# Altium project XUF208_Breakout.PrjPcb
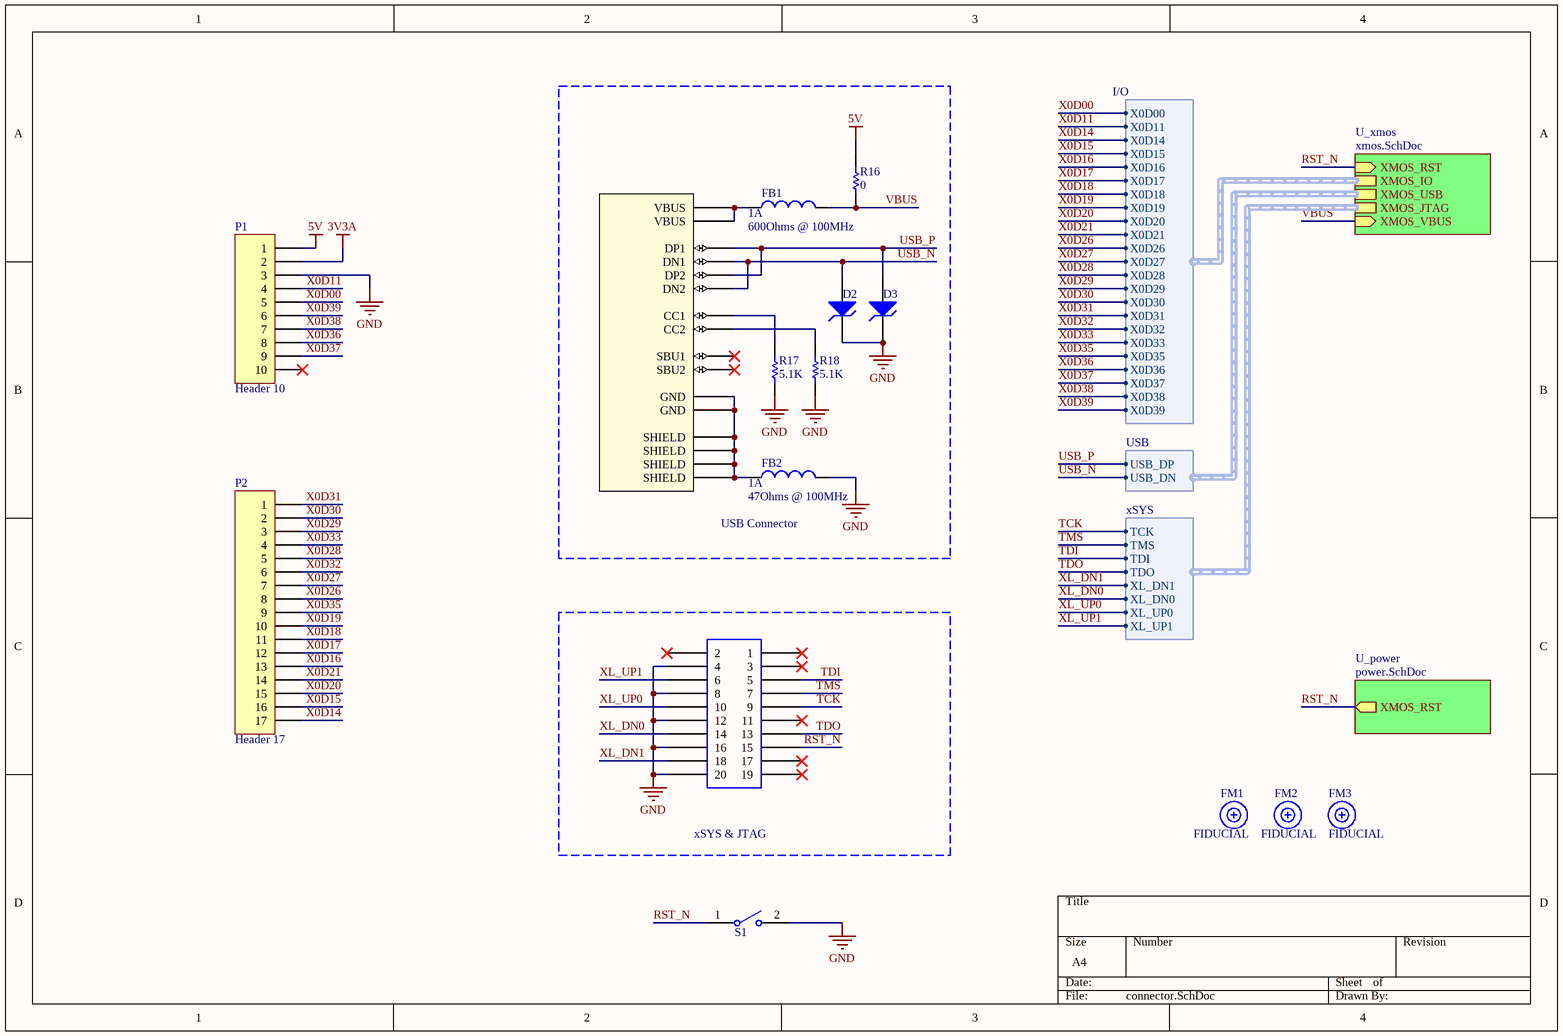
[diagram p0: connector.SchDoc]
3 sheets, 55 parts. Net scope: hierarchical (ports join the sheet entries above them; power ports are global).
Board file: XUF208_Breakout.PcbDoc
Sheets:
  connector.SchDoc
    U_power = power.SchDoc
    U_xmos = xmos.SchDoc

## Sheet connector.SchDoc
size A4; DocumentNumber: 3; SheetNumber: 3; SheetTotal: 3

### Parts
D2  ESD9B  [SOD-923-2]  (value not drawn)
D3  ESD9B  [SOD-923-2]  (value not drawn)
FB1  Impedance: 600Ohms @ 100MHz  MaximumDCCurrent: 1A  [IND_1608]  (hidden comment: Ferrite)
FB2  Impedance: 47Ohms @ 100MHz  MaximumDCCurrent: 1A  [IND_1608]  (hidden comment: Ferrite)
FM1  FIDUCIAL  [FIDUCIAL_10_20]
FM2  FIDUCIAL  [FIDUCIAL_10_20]
FM3  FIDUCIAL  [FIDUCIAL_10_20]
J1  USB C RECEPTACLE(1)  [USB C RECEPTACLE 2(1)]  (value not drawn)
J2  DC3-20P  [IDC-20 (1)]  (value not drawn)
P1  Header 10  [HDR1X10]
P2  Header 17  [HDR1X17]
R16  value 0  [RC0603N]  (hidden comment: RES)
R17  value 5.1K  [RC0603N]  (hidden comment: RES)
R18  value 5.1K  [RC0603N]  (hidden comment: RES)
S1  Tact Switch SPST  [TS_SPST_W4.2XD3.2]  (value not drawn)

### Blocks framed on the sheet
USB Connector: D2 D3 FB1 FB2 J1 R16-R18
xSYS & JTAG: J2

### Sub-sheets
U_power = power.SchDoc: XMOS_RST (out)
U_xmos = xmos.SchDoc: XMOS_IO (harness I/O), XMOS_JTAG (harness xSYS), XMOS_VBUS (in), XMOS_USB (harness USB), XMOS_RST (in)

### Harnesses
I/O: X0D00, X0D11, X0D14, X0D15, X0D16, X0D17, X0D18, X0D19, X0D20, X0D21, X0D26, X0D27, X0D28, X0D29, X0D30, X0D31, X0D32, X0D33, X0D35, X0D36, X0D37, X0D38, X0D39
xSYS: TCK, TMS, TDI, TDO, XL_DN1, XL_DN0, XL_UP0, XL_UP1
USB: USB_DP, USB_DN

### Nets
3V3A: P1.2
5V: P1.1 R16.2
GND: D2.2 D3.2 FB2.2 J2.4 J2.8 J2.12 J2.16 J2.20 P1.3 R17.1 R18.1 S1.2
RST_N: J2.15 S1.1 ; sheet U_power/XMOS_RST, sheet U_xmos/XMOS_RST
TCK: J2.9 ; sheet U_xmos/XMOS_JTAG.TCK
TDI: J2.5 ; sheet U_xmos/XMOS_JTAG.TDI
TDO: J2.13 ; sheet U_xmos/XMOS_JTAG.TDO
TMS: J2.7 ; sheet U_xmos/XMOS_JTAG.TMS
USB_N: D2.1 J1.A7(DN1) J1.B7(DN2) ; sheet U_xmos/XMOS_USB.USB_DN
USB_P: D3.1 J1.A6(DP1) J1.B6(DP2) ; sheet U_xmos/XMOS_USB.USB_DP
VBUS: FB1.2 R16.1 ; sheet U_xmos/XMOS_VBUS
X0D00: P1.5 ; sheet U_xmos/XMOS_IO.X0D00
X0D11: P1.4 ; sheet U_xmos/XMOS_IO.X0D11
X0D14: P2.17 ; sheet U_xmos/XMOS_IO.X0D14
X0D15: P2.16 ; sheet U_xmos/XMOS_IO.X0D15
X0D16: P2.13 ; sheet U_xmos/XMOS_IO.X0D16
X0D17: P2.12 ; sheet U_xmos/XMOS_IO.X0D17
X0D18: P2.11 ; sheet U_xmos/XMOS_IO.X0D18
X0D19: P2.10 ; sheet U_xmos/XMOS_IO.X0D19
X0D20: P2.15 ; sheet U_xmos/XMOS_IO.X0D20
X0D21: P2.14 ; sheet U_xmos/XMOS_IO.X0D21
X0D26: P2.8 ; sheet U_xmos/XMOS_IO.X0D26
X0D27: P2.7 ; sheet U_xmos/XMOS_IO.X0D27
X0D28: P2.5 ; sheet U_xmos/XMOS_IO.X0D28
X0D29: P2.3 ; sheet U_xmos/XMOS_IO.X0D29
X0D30: P2.2 ; sheet U_xmos/XMOS_IO.X0D30
X0D31: P2.1 ; sheet U_xmos/XMOS_IO.X0D31
X0D32: P2.6 ; sheet U_xmos/XMOS_IO.X0D32
X0D33: P2.4 ; sheet U_xmos/XMOS_IO.X0D33
X0D35: P2.9 ; sheet U_xmos/XMOS_IO.X0D35
X0D36: P1.8 ; sheet U_xmos/XMOS_IO.X0D36
X0D37: P1.9 ; sheet U_xmos/XMOS_IO.X0D37
X0D38: P1.7 ; sheet U_xmos/XMOS_IO.X0D38
X0D39: P1.6 ; sheet U_xmos/XMOS_IO.X0D39
XL_DN0: J2.14 ; sheet U_xmos/XMOS_JTAG.XL_DN0
XL_DN1: J2.18 ; sheet U_xmos/XMOS_JTAG.XL_DN1
XL_UP0: J2.10 ; sheet U_xmos/XMOS_JTAG.XL_UP0
XL_UP1: J2.6 ; sheet U_xmos/XMOS_JTAG.XL_UP1
NetFB1_1: FB1.1 J1.A4/B9(VBUS) J1.B4/A9(VBUS)
NetFB2_1: FB2.1 J1.A1/B12(GND) J1.B1/A12(GND) J1.SH1(SHIELD) J1.SH2(SHIELD) J1.SH3(SHIELD) J1.SH4(SHIELD)
NetJ1_A5: J1.A5(CC1) R17.2
NetJ1_B5: J1.B5(CC2) R18.2

Not connected (* = marked no-connect by the designer): J1 A8(SBU1)* B8(SBU2)*; J2 1* 2* 3* 11* 17* 19*; P1 10*

### Library data of the parts
D2 D3 = ESD9B: ESD Protection Diode; BreakdownVoltage: 5.8V; ClampingVoltage: 5V; VoltageESD: 18kV; PeakPulseCurrent: 1A; Capacitance: 15pF
FB1 FB2 = Ferrite: Ferrite Beads; Value: 10mH
FM1-FM3 = FIDUCIAL: Fiducial, dot
J1 = USB C RECEPTACLE(1): Universal Serial Bus (USB) I/O Receptacle, Type C, 2.0; Built_By: Gordon Mak
J2 = DC3-20P: 20-Pin Shrouded Header (IDC) Right Angle; Built_By: Gordon Mak
P1 = Header 10: Header, 10-Pin; LatestRevisionDate: 17-Jul-2002; LatestRevisionNote: Re-released for DXP Platform.; Publisher: Altium Limited
P2 = Header 17: Header, 17-Pin; LatestRevisionDate: 17-Jul-2002; LatestRevisionNote: Re-released for DXP Platform.; Publisher: Altium Limited
R16-R18 = RES: Chip Resistors; PowerRating: 0.25W
S1 = Tact Switch SPST: Switch

## Sheet power.SchDoc
size A4; DocumentNumber: 2; SheetNumber: 2; SheetTotal: 3
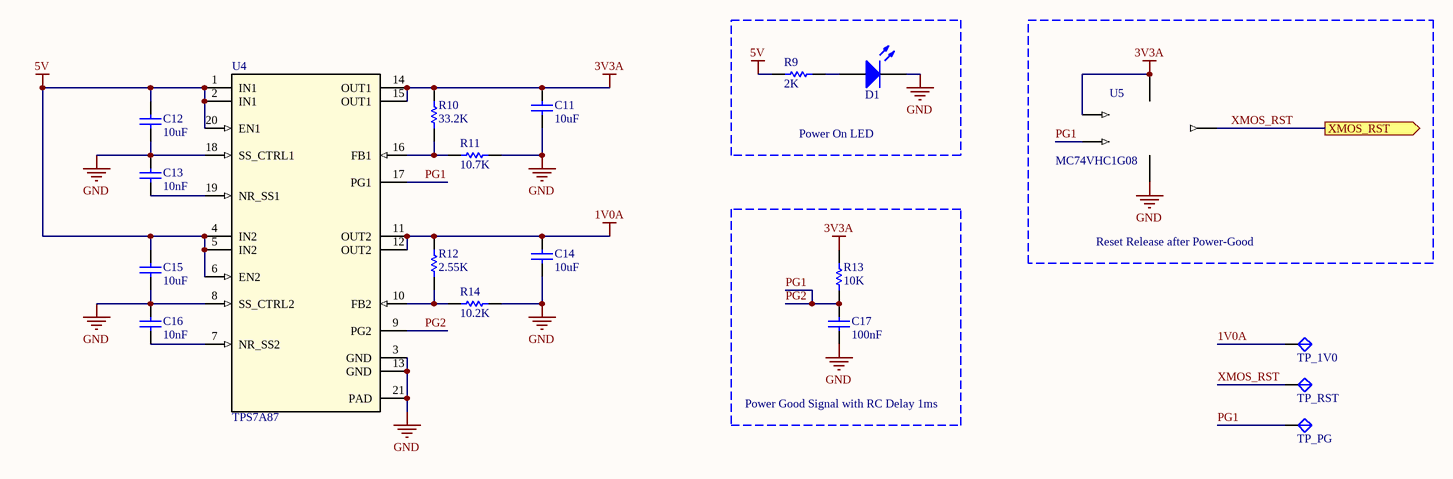
[diagram p1: power.SchDoc]

### Parts
C11  value 10uF  [CAP_0603]  (hidden comment: MLCC)
C12  value 10uF  [CAP_0603]  (hidden comment: MLCC)
C13  value 10nF  [CAP_0603]  (hidden comment: MLCC)
C14  value 10uF  [CAP_0603]  (hidden comment: MLCC)
C15  value 10uF  [CAP_0603]  (hidden comment: MLCC)
C16  value 10nF  [CAP_0603]  (hidden comment: MLCC)
C17  value 100nF  [CAP_0603]  (hidden comment: MLCC)
D1  LED  [0603_RED]  (value not drawn)
R9  value 2K  [RC0603N]  (hidden comment: RES)
R10  value 33.2K  [RC0603N]  (hidden comment: RES)
R11  value 10.7K  [RC0603N]  (hidden comment: RES)
R12  value 2.55K  [RC0603N]  (hidden comment: RES)
R13  value 10K  [RC0603N]  (hidden comment: RES)
R14  value 10.2K  [RC0603N]  (hidden comment: RES)
TP_1V0  TestPoint  [TESTPOINT(1)]  (value not drawn)
TP_PG  TestPoint  [TESTPOINT(1)]  (value not drawn)
TP_RST  TestPoint  [TESTPOINT(1)]  (value not drawn)
U4  TPS7A87  [RTJ20]
U5  MC74VHC1G08  [SC-88A]

### Blocks framed on the sheet
Power On LED: D1 R9
Reset Release after Power-Good: U5
Power Good Signal with RC Delay 1ms: C17 R13

### Ports
XMOS_RST (out)

### Nets
1V0A: C14.2 R12.2 TP_1V0.1 U4.11(OUT2) U4.12(OUT2)
3V3A: C11.2 R10.2 R13.1 U4.14(OUT1) U4.15(OUT1) U5.1(B) U5.5(VCC)
5V: C12.2 C15.2 R9.2 U4.1(IN1) U4.2(IN1) U4.4(IN2) U4.5(IN2) U4.6(EN2) U4.20(EN1)
GND: C11.1 C12.1 C13.2 C14.1 C15.1 C16.2 C17.1 D1.2(K) R11.1 R14.1 U4.3(GND) U4.8(SS_CTRL2) U4.13(GND) U4.18(SS_CTRL1) U4.21(PAD) U5.3(GND)
PG1: C17.2 R13.2 TP_PG.1 U4.9(PG2) U4.17(PG1) U5.2(A)  [also labelled PG2]
XMOS_RST: TP_RST.1 U5.4(Y) ; port XMOS_RST  [project net RST_N]
NetC13_1: C13.1 U4.19(NR_SS1)
NetC16_1: C16.1 U4.7(NR_SS2)
NetD1_1: D1.1(A) R9.1
NetR10_1: R10.1 R11.2 U4.16(FB1)
NetR12_1: R12.1 R14.2 U4.10(FB2)

### Library data of the parts
C11-C17 = MLCC: Multilayer Ceramic Capacitors; VoltageRatingDC: 5V; Tolerance: 10%
D1 = LED: LED Emitters; ForwardVoltage: 2V
R9-R14 = RES: Chip Resistors; PowerRating: 0.25W
TP_1V0 TP_PG TP_RST = TestPoint: Test Point
U4 = TPS7A87: TPS7A87 Dual, 500-mA, Low-Noise (3.8 μVRMS), LDO Voltage Regulator; Manufacturer: Texas Instruments; Manufacturer_Part_Number: TPS7A8701RTJR; Built_By: Texas_Instrument_Team; Copyright: Copyright (C) 2018 Accelerated Designs. All rights reserved; RefDes: RefDes; Type: DEV; Value: Value
U5 = MC74VHC1G08: Single 2-Input AND Gate; SupplyVoltageMax: 5.5V; SupplyVoltageMin: 2V

## Sheet xmos.SchDoc
size A4; DocumentNumber: 1; SheetNumber: 1; SheetTotal: 3
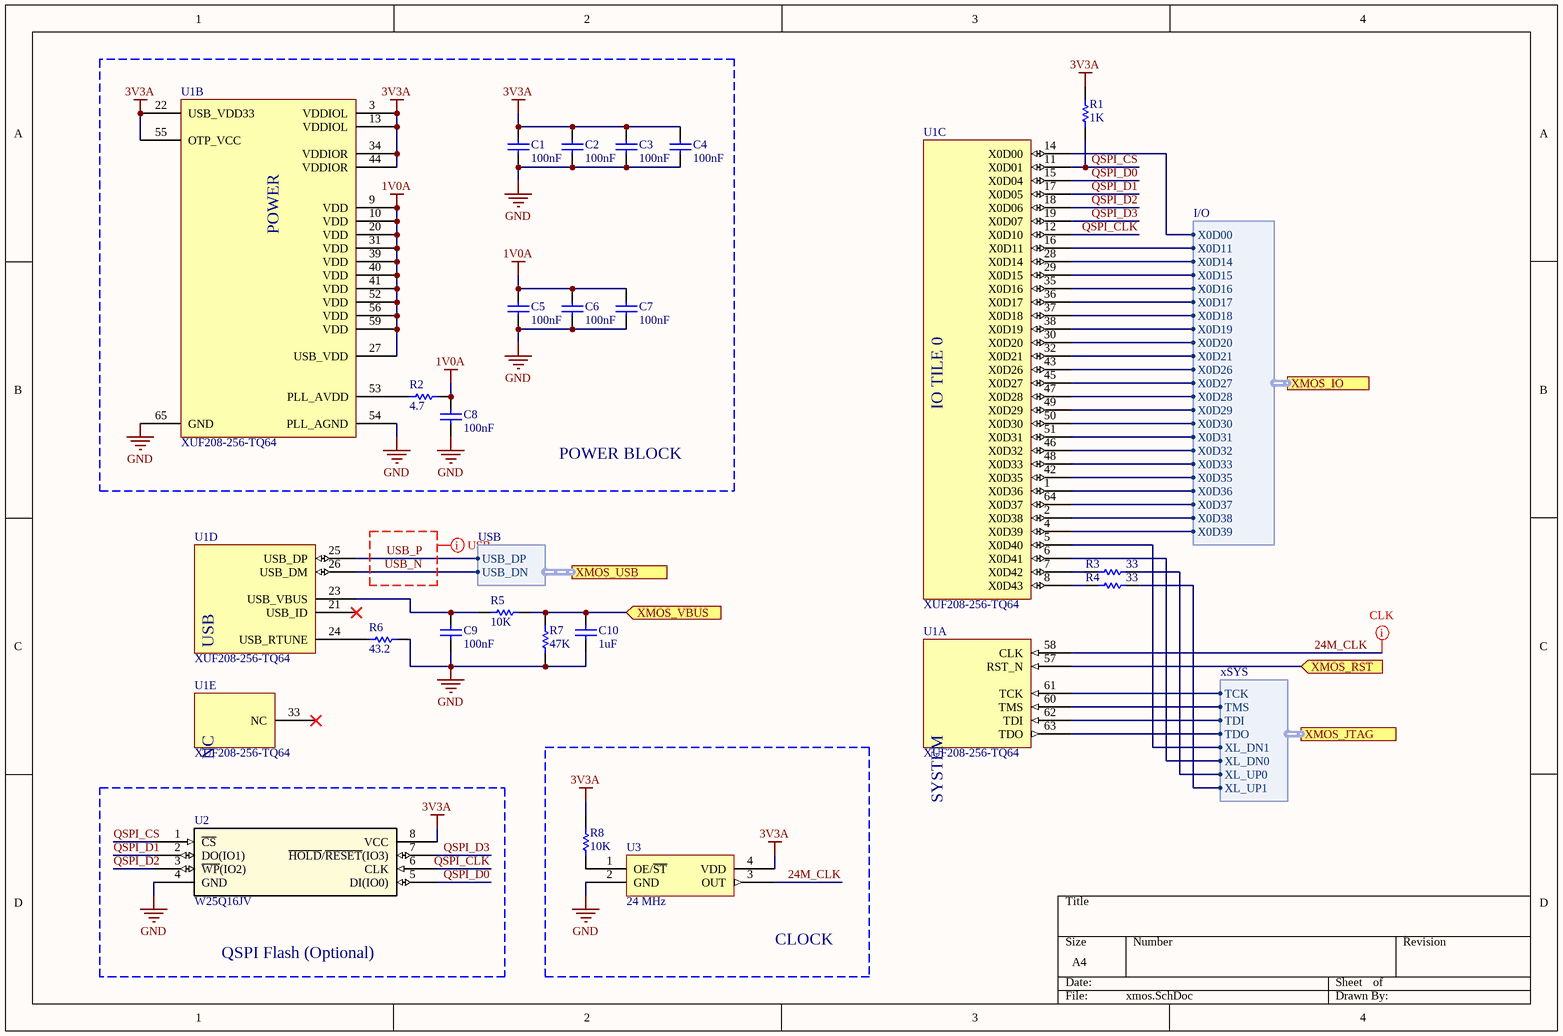
[diagram p2: xmos.SchDoc]

### Parts
C1  value 100nF  [CAP_0603]  (hidden comment: MLCC)
C2  value 100nF  [CAP_0603]  (hidden comment: MLCC)
C3  value 100nF  [CAP_0603]  (hidden comment: MLCC)
C4  value 100nF  [CAP_0603]  (hidden comment: MLCC)
C5  value 100nF  [CAP_0603]  (hidden comment: MLCC)
C6  value 100nF  [CAP_0603]  (hidden comment: MLCC)
C7  value 100nF  [CAP_0603]  (hidden comment: MLCC)
C8  value 100nF  [CAP_0603]  (hidden comment: MLCC)
C9  value 100nF  [CAP_0603]  (hidden comment: MLCC)
C10  value 1uF  [CAP_0603]  (hidden comment: MLCC)
R1  value 1K  [RC0603N]  (hidden comment: RES)
R2  value 4.7  [RC0603N]  (hidden comment: RES)
R3  value 33  [RC0603N]  (hidden comment: RES)
R4  value 33  [RC0603N]  (hidden comment: RES)
R5  value 10K  [RC0603N]  (hidden comment: RES)
R6  value 43.2  [RC0603N]  (hidden comment: RES)
R7  value 47K  [RC0603N]  (hidden comment: RES)
R8  value 10K  [RC0603N]  (hidden comment: RES)
U1  XUF208-256-TQ64  [TQ64]  (parts A,B,C,D,E of 5)
U2  W25Q16JV  [SOIC-8_150MIL]
U3  Frequency: 24 MHz  [QFN_3225_4P]  (hidden comment: XO)

### Blocks framed on the sheet
POWER BLOCK: C1-C8 R2 U1
CLOCK: R8 U3
QSPI Flash (Optional): U2

### Ports
XMOS_IO (harness I/O), XMOS_JTAG (harness xSYS), XMOS_RST (in), XMOS_USB (harness USB), XMOS_VBUS (in)

### Harnesses
xSYS: TCK, TMS, TDI, TDO, XL_DN1, XL_DN0, XL_UP0, XL_UP1
I/O: X0D00, X0D11, X0D14, X0D15, X0D16, X0D17, X0D18, X0D19, X0D20, X0D21, X0D26, X0D27, X0D28, X0D29, X0D30, X0D31, X0D32, X0D33, X0D35, X0D36, X0D37, X0D38, X0D39
USB: USB_DP, USB_DN

### Nets
1V0A: C5.2 C6.2 C7.2 C8.2 R2.2 U1.9(VDD) U1.10(VDD) U1.20(VDD) U1.27(USB_VDD) U1.31(VDD) U1.39(VDD) U1.40(VDD) U1.41(VDD) U1.52(VDD) U1.56(VDD) U1.59(VDD)
3V3A: C1.2 C2.2 C3.2 C4.2 R1.2 R8.2 U1.3(VDDIOL) U1.13(VDDIOL) U1.22(USB_VDD33) U1.34(VDDIOR) U1.44(VDDIOR) U1.55(OTP_VCC) U2.8(VCC) U3.4(VDD)
GND: C1.1 C2.1 C3.1 C4.1 C5.1 C6.1 C7.1 C8.1 C9.1 C10.2 R6.2 R7.1 U1.54(PLL_AGND) U1.65(GND) U2.4(GND) U3.2(GND)
24M_CLK: U1.58(CLK) U3.3(OUT)
QSPI_CLK: U1.12(X0D10) U2.6(CLK)
QSPI_CS: R1.1 U1.11(X0D01) U2.1(~{CS})
QSPI_D0: U1.15(X0D04) U2.5(DI(IO0))
QSPI_D1: U1.17(X0D05) U2.2(DO(IO1))
QSPI_D2: U1.18(X0D06) U2.3(~{WP}(IO2))
QSPI_D3: U1.19(X0D07) U2.7(~{HOLD}/~{RESET}(IO3))
RST_N: U1.57(RST_N) ; port XMOS_RST
TCK: U1.61(TCK) ; port XMOS_JTAG.TCK
TDI: U1.62(TDI) ; port XMOS_JTAG.TDI
TDO: U1.63(TDO) ; port XMOS_JTAG.TDO
TMS: U1.60(TMS) ; port XMOS_JTAG.TMS
USB_N: U1.26(USB_DM) ; port XMOS_USB.USB_DN
USB_P: U1.25(USB_DP) ; port XMOS_USB.USB_DP
VBUS: C10.1 R5.2 R7.2 ; port XMOS_VBUS
X0D00: U1.14(X0D00) ; port XMOS_IO.X0D00
X0D11: U1.16(X0D11) ; port XMOS_IO.X0D11
X0D14: U1.28(X0D14) ; port XMOS_IO.X0D14
X0D15: U1.29(X0D15) ; port XMOS_IO.X0D15
X0D16: U1.35(X0D16) ; port XMOS_IO.X0D16
X0D17: U1.36(X0D17) ; port XMOS_IO.X0D17
X0D18: U1.37(X0D18) ; port XMOS_IO.X0D18
X0D19: U1.38(X0D19) ; port XMOS_IO.X0D19
X0D20: U1.30(X0D20) ; port XMOS_IO.X0D20
X0D21: U1.32(X0D21) ; port XMOS_IO.X0D21
X0D26: U1.43(X0D26) ; port XMOS_IO.X0D26
X0D27: U1.45(X0D27) ; port XMOS_IO.X0D27
X0D28: U1.47(X0D28) ; port XMOS_IO.X0D28
X0D29: U1.49(X0D29) ; port XMOS_IO.X0D29
X0D30: U1.50(X0D30) ; port XMOS_IO.X0D30
X0D31: U1.51(X0D31) ; port XMOS_IO.X0D31
X0D32: U1.46(X0D32) ; port XMOS_IO.X0D32
X0D33: U1.48(X0D33) ; port XMOS_IO.X0D33
X0D35: U1.42(X0D35) ; port XMOS_IO.X0D35
X0D36: U1.1(X0D36) ; port XMOS_IO.X0D36
X0D37: U1.64(X0D37) ; port XMOS_IO.X0D37
X0D38: U1.2(X0D38) ; port XMOS_IO.X0D38
X0D39: U1.4(X0D39) ; port XMOS_IO.X0D39
XL_DN0: U1.6(X0D41) ; port XMOS_JTAG.XL_DN0
XL_DN1: U1.5(X0D40) ; port XMOS_JTAG.XL_DN1
XL_UP0: R3.2 ; port XMOS_JTAG.XL_UP0
XL_UP1: R4.2 ; port XMOS_JTAG.XL_UP1
NetC9_2: C9.2 R5.1 U1.23(USB_VBUS)
NetR2_1: R2.1 U1.53(PLL_AVDD)
NetR3_1: R3.1 U1.7(X0D42)
NetR4_1: R4.1 U1.8(X0D43)
NetR6_1: R6.1 U1.24(USB_RTUNE)
NetR8_1: R8.1 U3.1(OE/~{ST})

Not connected (* = marked no-connect by the designer): U1 21(USB_ID)* 33(NC)*

### Layout directives
differential pair; differential pair class USB_DIFFPAIR; net class USB; rule Differential Pairs Routing [Pref Gap = 5mil    Min Gap  = 5mil    Max Gap  = 30milPref Width = 8.1mil    Min Width  = 8.1mil    Max Width  = 8.1mil]: USB_N, USB_P
net class CLK; rule Width Constraint [Pref Width = 11.55mil    Min Width = 11mil    Max Width = 12mil]: 24M_CLK

### Notes on the sheet
- (in symbol XUF208-256-TQ64, part A) SYSTEM
- (in symbol XUF208-256-TQ64, part B) POWER
- (in symbol XUF208-256-TQ64, part C) IO TILE 0
- (in symbol XUF208-256-TQ64, part D) USB

### Library data of the parts
C1-C10 = MLCC: as C11 on sheet power
R1-R8 = RES: Chip Resistors; PowerRating: 0.25W
U1 = XUF208-256-TQ64: xCORE Multicore Microcontroller, xCORE-200, USB, Single Tile, 8 Cores, 500MHz, 64TQFP; Manufacturer: XMOS; Manufacturer Part Number: XUF208-256-TQ64; Value: XUF208-256-TQ64
U2 = W25Q16JV: 3V 16M-BIT SERIAL FLASH MEMORY WITH DUAL/QUAD SPI; Manufacturer_Part_Number: W25Q16JVXXXX; Vendor: Winbond; Built_By: EMA_Anthony; Copyright: Copyright (C) 2018 Accelerated Designs. All rights reserved; RefDes: RefDes; Type: DEV; Value: Value
U3 = XO: SiTime Ultra Performance Oscillator; Manufacturer: SiTime; ComponentLink1Description: Manufacturer URL; ComponentLink1URL: https://www.sitime.com; ComponentLink2Description: Datasheet; ComponentLink2URL: https://www.sitime.com/datasheet/SiT8208

## Nets that join several sheets
1V0A: power (5 pins), xmos (16 pins)
3V3A: connector (P1.2), power (7 pins), xmos (14 pins)
5V: connector (P1.1 R16.2), power (9 pins)
GND: connector (12 pins), power (16 pins), xmos (16 pins)
RST_N: connector (J2.15 S1.1), power (TP_RST.1 U5.4), xmos (U1.57)
TCK: connector (J2.9), xmos (U1.61)
TDI: connector (J2.5), xmos (U1.62)
TDO: connector (J2.13), xmos (U1.63)
TMS: connector (J2.7), xmos (U1.60)
USB_N: connector (D2.1 J1.A7 J1.B7), xmos (U1.26)
USB_P: connector (D3.1 J1.A6 J1.B6), xmos (U1.25)
VBUS: connector (FB1.2 R16.1), xmos (C10.1 R5.2 R7.2)
X0D00: connector (P1.5), xmos (U1.14)
X0D11: connector (P1.4), xmos (U1.16)
X0D14: connector (P2.17), xmos (U1.28)
X0D15: connector (P2.16), xmos (U1.29)
X0D16: connector (P2.13), xmos (U1.35)
X0D17: connector (P2.12), xmos (U1.36)
X0D18: connector (P2.11), xmos (U1.37)
X0D19: connector (P2.10), xmos (U1.38)
X0D20: connector (P2.15), xmos (U1.30)
X0D21: connector (P2.14), xmos (U1.32)
X0D26: connector (P2.8), xmos (U1.43)
X0D27: connector (P2.7), xmos (U1.45)
X0D28: connector (P2.5), xmos (U1.47)
X0D29: connector (P2.3), xmos (U1.49)
X0D30: connector (P2.2), xmos (U1.50)
X0D31: connector (P2.1), xmos (U1.51)
X0D32: connector (P2.6), xmos (U1.46)
X0D33: connector (P2.4), xmos (U1.48)
X0D35: connector (P2.9), xmos (U1.42)
X0D36: connector (P1.8), xmos (U1.1)
X0D37: connector (P1.9), xmos (U1.64)
X0D38: connector (P1.7), xmos (U1.2)
X0D39: connector (P1.6), xmos (U1.4)
XL_DN0: connector (J2.14), xmos (U1.6)
XL_DN1: connector (J2.18), xmos (U1.5)
XL_UP0: connector (J2.10), xmos (R3.2)
XL_UP1: connector (J2.6), xmos (R4.2)